# EasyEDA schematic 1-Schematic_reverse polarity protection.json
TITLE: Sheet_1; REV: 1.0; Date: 2019-06-09; Sheet: 1/1; Drawn By: n00br0x; Company: Your Company
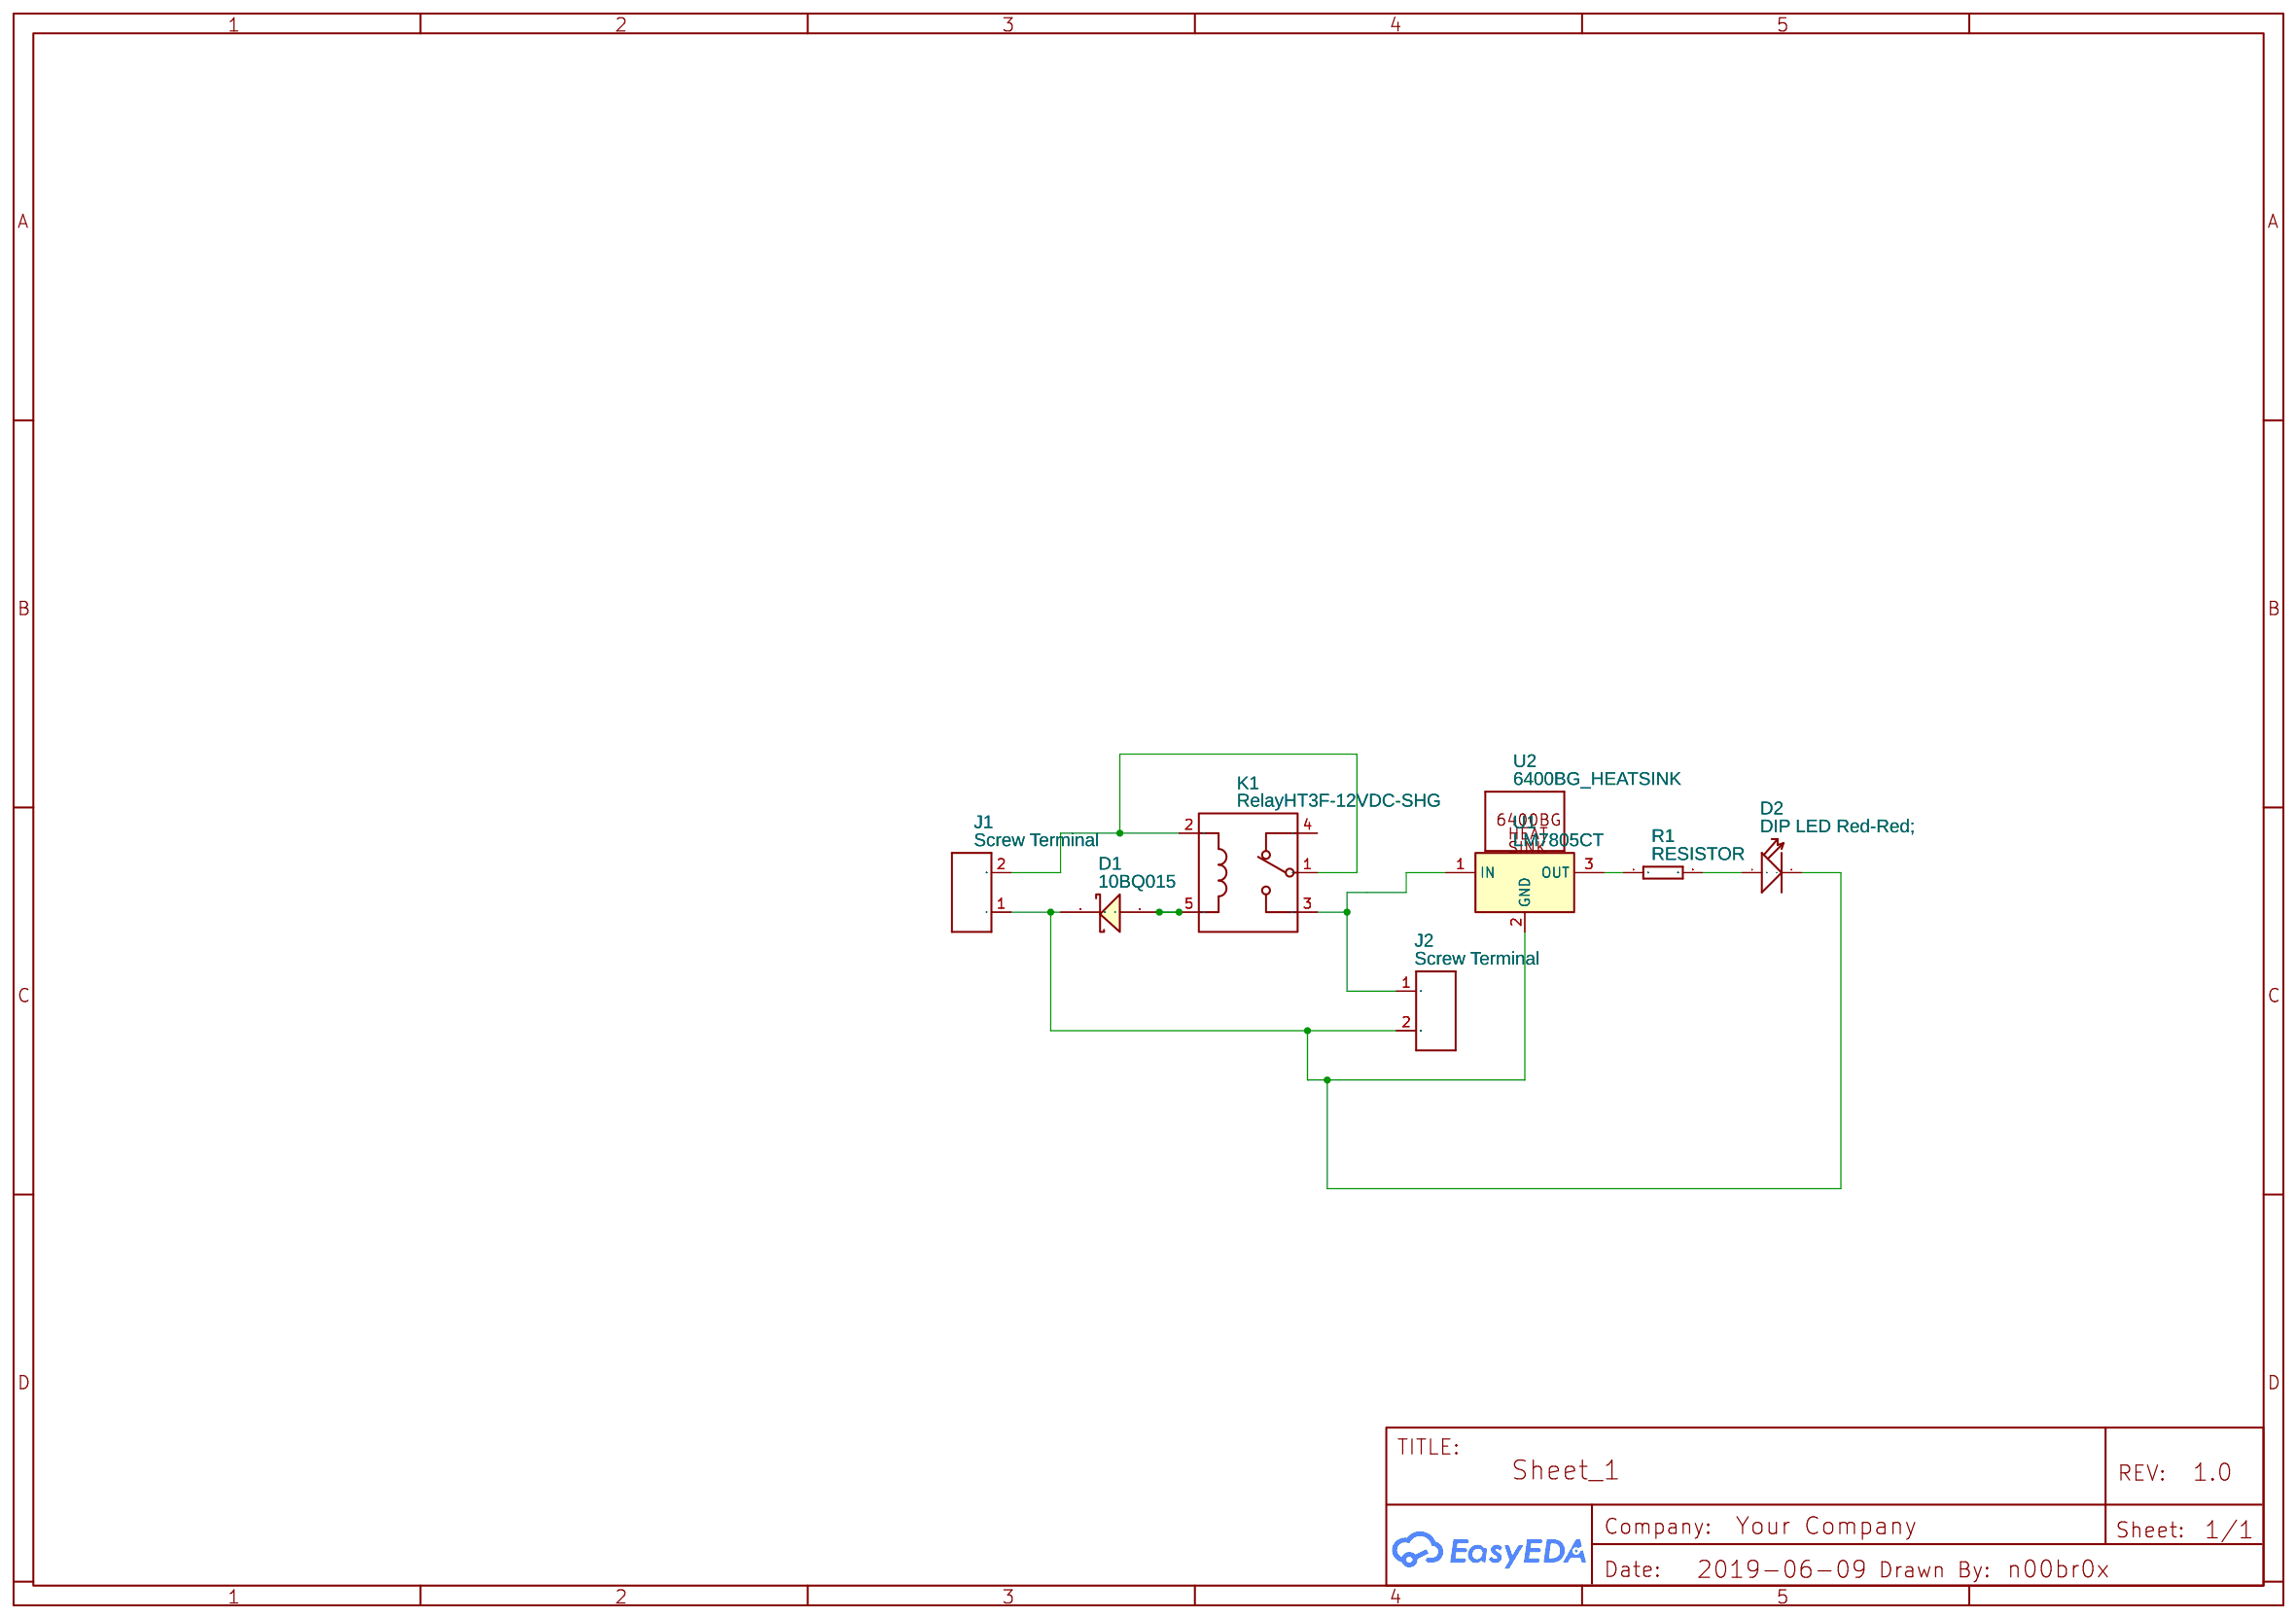
[diagram p0: schematic sheet]

## Parts
D1  10BQ015  [SMB]
D2  DIP LED Red-Red;  [LED2-2.54-D3.0MM]
J1  Screw Terminal  [H2-5.0-10.5X8.0MM]
J2  Screw Terminal  [H2-5.0-10.5X8.0MM]
K1  RelayHT3F-12VDC-SHG  [RELAY-TH_5PIN_HT3F-12VDC-SHG]
R1  RESISTOR  [RTH025W]
U1  LM7805CT  [TO-220_VERTICAL]
U2  6400BG_HEATSINK  [6400BG_HEATSINK]

## Library data of the parts
D1 = -: Schottky Rectifier; Manufacturer Part: ?
D2 J1 J2 = -: Manufacturer Part: ?
K1 = -: Supplier: LCSC; Manufacturer: HTV; image: //image.lceda.cn/szlcsc/C22022.jpg; Supplier Part: C22022
R1 = -: Contributor: DangerousPrototype; Manufacturer Part: ?
U1 = -: Contributor: KiCAD; license: https://www.gnu.org/licenses/lgpl-2.1.html; Manufacturer Part: ?
U2 = -: Multiwatt heatsink, PRT-09576; Contributor: SparkFun; Manufacturer Part: ?

## Nets
GND: D1.2(K) D2.K(-) J1.1 J2.2 U1.2(GND)
D2_A: D2.A(+) R1.2
K1_2: J1.2 K1.1 K1.2
K1_3: J2.1 K1.3 U1.1(IN)
K1_5: D1.1(A) K1.5
U1_3: R1.1 U1.3(OUT)

Not connected (* = marked no-connect by the designer): K1 4
